# EAGLE design mainboard (EAGLE 9.5.2)

## Sheet 1 of 2
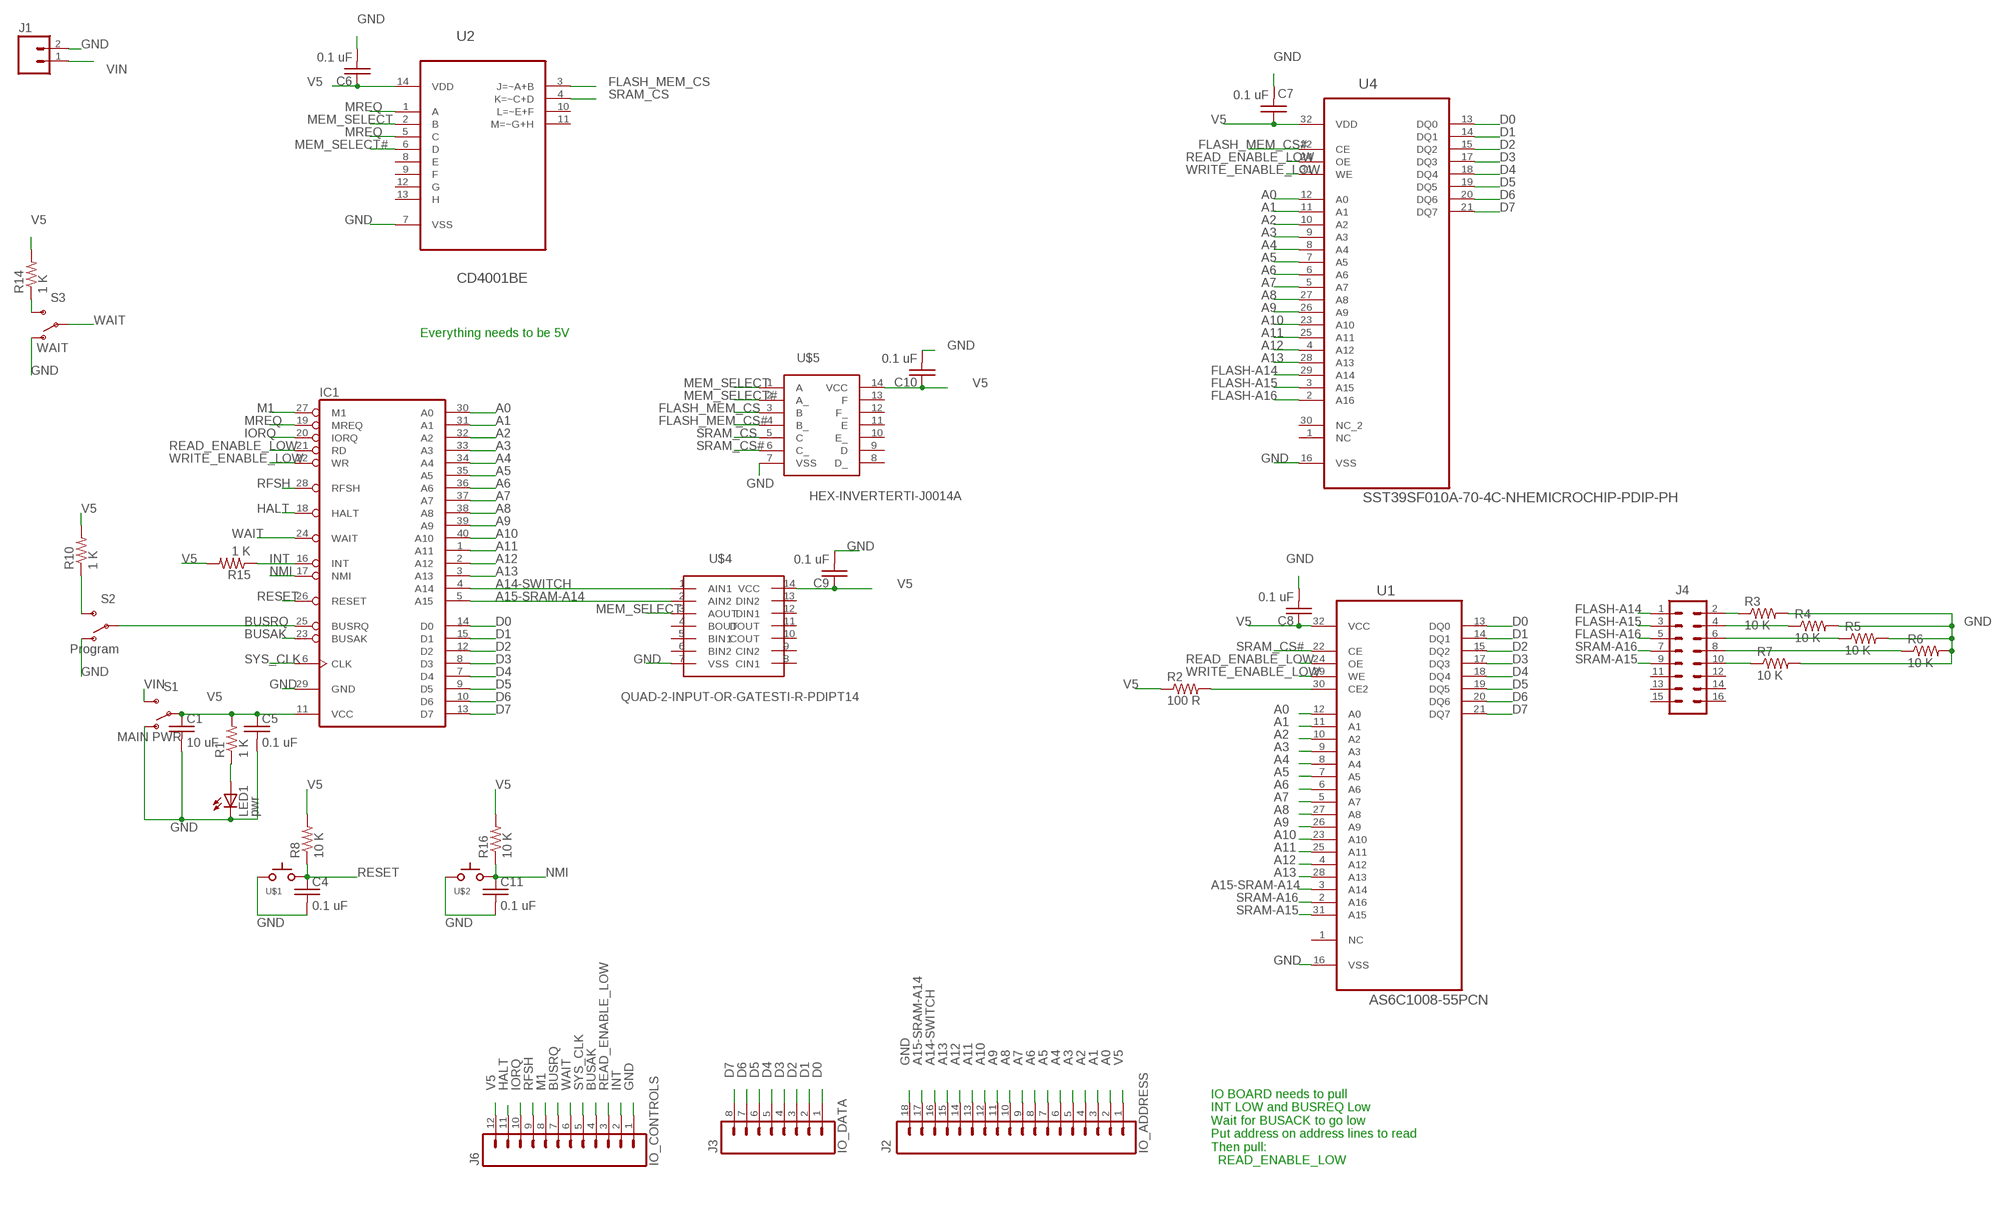
[diagram p0: schematic, sheet 1]

### Parts
C1  10 uF  C-USC0805K  [C0805K]
C4  0.1 uF  C-USC0805K  [C0805K]
C5  0.1 uF  C-USC0805K  [C0805K]
C6  0.1 uF  C-USC0805K  [C0805K]
C7  0.1 uF  C-USC0805K  [C0805K]
C8  0.1 uF  C-USC0805K  [C0805K]
C9  0.1 uF  C-USC0805K  [C0805K]
C10  0.1 uF  C-USC0805K  [C0805K]
C11  0.1 uF  C-USC0805K  [C0805K]
IC1  Z80CPU  [DIL40]
J1  M02PTH  [1X02]
J2  IO_ADDRESS  M18_  [1X18]
J3  IO_DATA  M08LOCK_LONGPADS  [1X08_LOCK_LONGPADS]
J4  M08X2  [2X8]
J6  IO_CONTROLS  M12LONGPADS  [1X12_LONGPADS]
LED1  pwr  LED1206  [LED-1206]
R1  1 K  RESISTOR0805-RES  [0805]
R2  100 R  RESISTOR0805-RES  [0805]
R3  10 K  RESISTOR0805-RES  [0805]
R4  10 K  RESISTOR0805-RES  [0805]
R5  10 K  RESISTOR0805-RES  [0805]
R6  10 K  RESISTOR0805-RES  [0805]
R7  10 K  RESISTOR0805-RES  [0805]
R8  10 K  RESISTOR0805-RES  [0805]
R10  1 K  RESISTOR0805-RES  [0805]
R14  1 K  RESISTOR0805-RES  [0805]
R15  1 K  RESISTOR0805-RES  [0805]
R16  10 K  RESISTOR0805-RES  [0805]
S1  MAIN PWR  SWITCH-SPSTKIT  [SWITCH-SPDT_KIT]
S2  Program  SWITCH-SPSTKIT  [SWITCH-SPDT_KIT]
S3  WAIT  SWITCH-SPSTKIT  [SWITCH-SPDT_KIT]
U1  AS6C1008-55PCN  [DIP254P1524X393-32]
U2  CD4001BE  [DIP254P762X508-14]
U4  SST39SF010A-70-4C-NHEMICROCHIP-PDIP-PH  [DIP1574W53P254L4191H508Q32B]
U$1  SWITCH_TACTILETACTILE-2PIN-NARROW  [TACTILE-2PIN-NARROW]
U$2  SWITCH_TACTILETACTILE-2PIN-NARROW  [TACTILE-2PIN-NARROW]
U$4  QUAD-2-INPUT-OR-GATESTI-R-PDIPT14  [DIP762W36P254L1981H508Q14B]
U$5  HEX-INVERTERTI-J0014A  [DIP797W66P254L1954H508Q14B]

### Nets
A0: IC1.30(A0) J2.2 U1.12(A0) U4.12(A0)
A1: IC1.31(A1) J2.3 U1.11(A1) U4.11(A1)
A2: IC1.32(A2) J2.4 U1.10(A2) U4.10(A2)
A3: IC1.33(A3) J2.5 U1.9(A3) U4.9(A3)
A4: IC1.34(A4) J2.6 U1.8(A4) U4.8(A4)
A5: IC1.35(A5) J2.7 U1.7(A5) U4.7(A5)
A6: IC1.36(A6) J2.8 U1.6(A6) U4.6(A6)
A7: IC1.37(A7) J2.9 U1.5(A7) U4.5(A7)
A8: IC1.38(A8) J2.10 U1.27(A8) U4.27(A8)
A9: IC1.39(A9) J2.11 U1.26(A9) U4.26(A9)
A10: IC1.40(A10) J2.12 U1.23(A10) U4.23(A10)
A11: IC1.1(A11) J2.13 U1.25(A11) U4.25(A11)
A12: IC1.2(A12) J2.14 U1.4(A12) U4.4(A12)
A13: IC1.3(A13) J2.15 U1.28(A13) U4.28(A13)
A14-SWITCH: IC1.4(A14) J2.16 U$4.1(AIN1)
A15-SRAM-A14: IC1.5(A15) J2.17 U1.3(A14) U$4.2(AIN2)
BUSAK: IC1.23(BUSAK) J6.4
BUSRQ: IC1.25(BUSRQ) J6.7 S2.2(P)
D0: IC1.14(D0) J3.1 U1.13(DQ0) U4.13(DQ0)
D1: IC1.15(D1) J3.2 U1.14(DQ1) U4.14(DQ1)
D2: IC1.12(D2) J3.3 U1.15(DQ2) U4.15(DQ2)
D3: IC1.8(D3) J3.4 U1.17(DQ3) U4.17(DQ3)
D4: IC1.7(D4) J3.5 U1.18(DQ4) U4.18(DQ4)
D5: IC1.9(D5) J3.6 U1.19(DQ5) U4.19(DQ5)
D6: IC1.10(D6) J3.7 U1.20(DQ6) U4.20(DQ6)
D7: IC1.13(D7) J3.8 U1.21(DQ7) U4.21(DQ7)
FLASH-A14: J4.1 U4.29(A14)
FLASH-A15: J4.3 U4.3(A15)
FLASH-A16: J4.5 U4.2(A16)
FLASH_MEM_CS: U2.3(J=~A+B) U$5.3(B)
FLASH_MEM_CS#: U4.22(CE) U$5.4(B_)
GND: C1.2 C4.2 C5.2 C6.2 C7.2 C8.2 C9.2 C10.2 C11.2 IC1.29(GND) J1.2 J2.18 J6.1 LED1.C R3.2 R4.2 R5.2 R6.2 R7.2 S1.1(O) S2.1(O) S3.1(O) U1.16(VSS) U2.7(VSS) U4.16(VSS) U$1.P$2(C) U$2.P$2(C) U$4.7(VSS) U$5.7(VSS)
HALT: IC1.18(HALT) J6.11
INT: IC1.16(INT) J6.2 R15.1
IORQ: IC1.20(IORQ) J6.10
M1: IC1.27(M1) J6.8
MEM_SELECT: U2.2(B) U$4.3(AOUT) U$5.1(A)
MEM_SELECT#: U2.6(D) U$5.2(A_)
MREQ: IC1.19(MREQ) U2.1(A) U2.5(C)
N$1: LED1.A R1.1
N$2: R10.1 S2.3(S)
N$4: R2.2 U1.30(CE2)
N$5: J4.2 R3.1
N$6: J4.4 R4.1
N$7: J4.6 R5.1
N$8: J4.8 R6.1
N$9: J4.10 R7.1
N$16: R14.1 S3.3(S)
NMI: C11.1 IC1.17(NMI) R16.1 U$2.P$1(A)
READ_ENABLE_LOW: IC1.21(RD) J6.3 U1.24(OE) U4.24(OE)
RESET: C4.1 IC1.26(RESET) R8.1 U$1.P$1(A)
RFSH: IC1.28(RFSH) J6.9
SRAM-A15: J4.9 U1.31(A15)
SRAM-A16: J4.7 U1.2(A16)
SRAM_CS: U2.4(K=~C+D) U$5.5(C)
SRAM_CS#: U1.22(CE) U$5.6(C_)
SYS_CLK: IC1.6(CLK) J6.5
V5: C1.1 C5.1 C6.1 C7.1 C8.1 C9.1 C10.1 IC1.11(VCC) J2.1 J6.12 R1.2 R2.1 R8.2 R10.2 R14.2 R15.2 R16.2 S1.2(P) U1.32(VCC) U2.14(VDD) U4.32(VDD) U$4.14(VCC) U$5.14(VCC)
VIN: J1.1 S1.3(S)
WAIT: IC1.24(WAIT) J6.6 S3.2(P)
WRITE_ENABLE_LOW: IC1.22(WR) U1.29(WE) U4.31(WE)
Unconnected: J4.11 J4.12 J4.13 J4.14 J4.15 J4.16 U1.1(NC) U2.8(E) U2.9(F) U2.10(L=~E+F) U2.11(M=~G+H) U2.12(G) U2.13(H) U4.1(NC) U4.30(NC_2) U$4.4(BOUT) U$4.5(BIN1) U$4.6(BIN2) U$4.8(CIN1) U$4.9(CIN2) U$4.10(COUT) U$4.11(DOUT) U$4.12(DIN1) U$4.13(DIN2) U$5.8(D_) U$5.9(D) U$5.10(E_) U$5.11(E) U$5.12(F_) U$5.13(F)

### Notes on the sheet
- Everything needs to be 5V
- IO BOARD needs to pull 
  INT LOW and BUSREQ Low
  Wait for BUSACK to go low
  Put address on address lines to read
  Then pull:
    READ_ENABLE_LOW

## Sheet 2 of 2
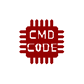
[diagram p1: schematic, sheet 2]

### Parts
U$3  CMD_C0DE_LOGOCMD_CODE_LOGO_SILK  [CMD_C0DE_LOGO_SILK]

## Library data of the parts
C1 C4-C11 = passives:C-US: CAPACITOR, American symbol
IC1 = zilog:Z80CPU: Z80 FAMILY DEVICE
J1 = connector:M02: Standard 2-pin 0.1" header. Use with - straight break away headers ( PRT-00116) - right angle break away headers (PRT-00553) - swiss pins (PRT-00743) - machine pins (PRT-00117) - female headers (PRT-00115) Molex polarized connector foot print use with: PRT-08233 with associated crimp pins and housings. 2.54_SCREWTERM for use with PRT-10571. 3.5mm Screw Terminal footprints for PRT-08084 5mm Screw Terminal footprints for use with PRT-08432
J2 = connector:M18: 1x18 .1" header
J3 = connector:M08: Header 8 Standard 8-pin 0.1" header. Use with straight break away headers (SKU : PRT-00116), right angle break away headers (PRT-00553), swiss pins (PRT-00743), machine pins (PRT-00117), and female headers (PRT-00115).
J4 = connector:M08X2: .1" headers, two rows of 8 each
J6 = connector:M12: Header 12 Standard 12-pin 0.1" header. Use with straight break away headers (SKU : PRT-00116), right angle break away headers (PRT-00553), swiss pins (PRT-00743), machine pins (PRT-00117), and female headers (PRT-00115).
LED1 = leds:LED: LEDs Standard schematic elements and footprints for 5mm, 3mm, 1206, and 0603 sized LEDs. 5mm - Spark Fun Electronics SKU : COM-00529 (and others)
R1-R8 R10 R14-R16 = passives:RESISTOR: Resistor Basic schematic elements and footprints for 0603, 1206, and PTH resistors.
S1-S3 = switches:SWITCH-SPST: SPST Switch Simple slide switch.
U1 = memories:AS6C1008-55PCN: CMOS SRAM; AVAILABILITY: Unavailable; DESCRIPTION: SRAM - Asynchronous Memory IC 1Mb _128K x 8_ Parallel 55ns 32-PDIP; MF: Alliance Memory,; MP: AS6C1008-55PCN; PACKAGE: DIP-32 Alliance Semiconductor; PRICE: None
U2 = logic:CD4001BE: CMOS NOR Gates; AVAILABILITY: Unavailable; DESCRIPTION: NOR Gate IC 4 Channel 14-PDIP; MF: Texas Instruments; MP: CD4001BE; PACKAGE: PDIP-14 Intersil; PRICE: None
U4 = memories:SST39SF010A-70-4C-NHE: 1MB Flash; DESCRIPTION: SST39SF Series 1 Mbit 128 K x 8 5 V Multi-Purpose Flash - PLCC-32; MP: SST39SF010A-70-4C-NHE
U$1 U$2 = switches:SWITCH_TACTILE
U$3 = logos:CMD_C0DE_LOGO
U$4 = logic:QUAD-2-INPUT-OR-GATES
U$5 = logic:HEX-INVERTER

## Board
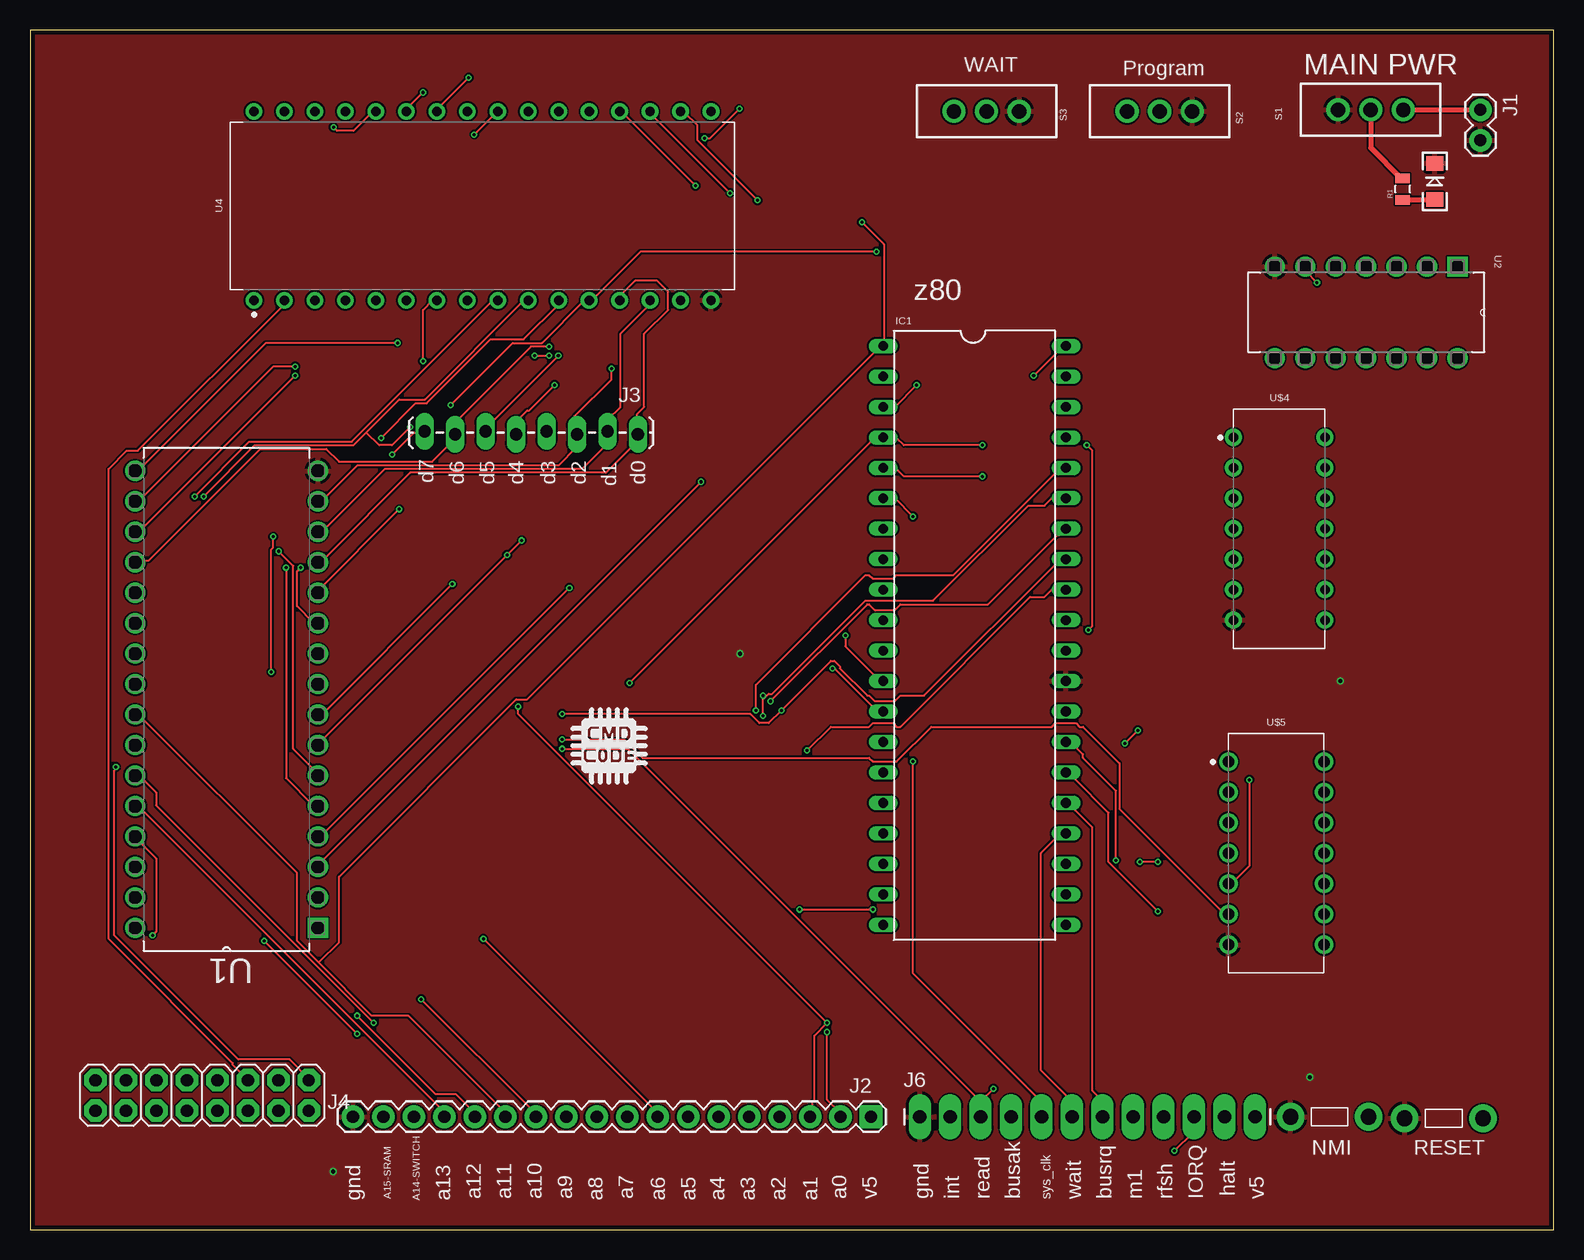
[diagram p2: board, top side]
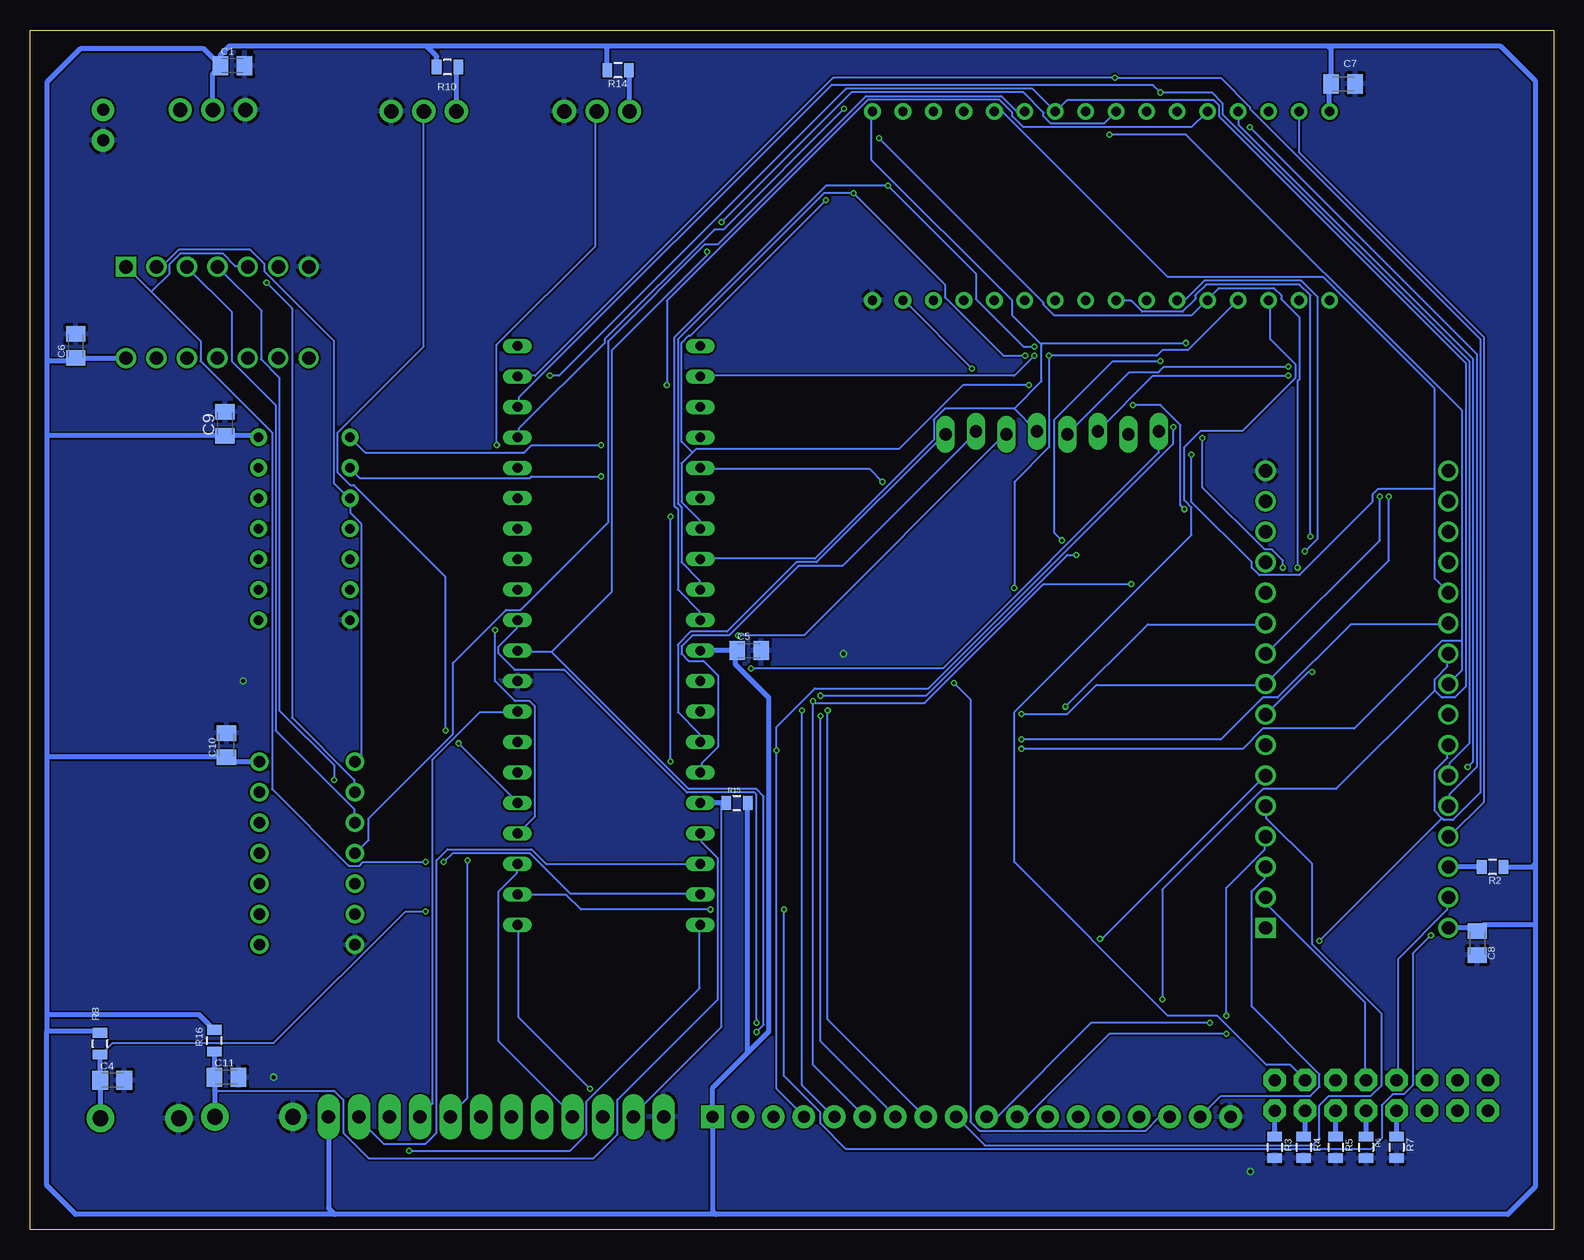
[diagram p3: board, bottom side, seen from below]

Size 127 x 100 mm. Coordinates in mm from the lower left corner, seen from the top.
Outline: 0,0 127,0 127,100 0,100 0,0
Copper layers (1*16): Top 0.035559375mm / dielectric 1.6mm / Bottom 0.035559375mm
Design rules "oshpark-2layer": minimum track width 6mil, minimum drill 10mil, track to track 6mil, track to pad 6mil, pad to pad 6mil, via to via 6mil, smd to smd 6mil, copper to edge 15mil, drill to drill 6mil, minimum pad ring 5mil, minimum via ring 5mil, stop-mask expansion 2.5mil, vias tented up to drill 0mil, thermal gap 10mil

### Footprints (pad centres in the part's own frame; a part is rotated, then mirrored left to right if it is on the bottom)
C0805K = smd 1.3 x 1.6: 1 -1,0; 2 1,0
DIL40 = drill 0.813 long: 1 -24.13,-7.62; 2 -21.59,-7.62; 3 -19.05,-7.62; 4 -16.51,-7.62; 5 -13.97,-7.62; 6 -11.43,-7.62; 7 -8.89,-7.62; 8 -6.35,-7.62; 9 -3.81,-7.62; 10 -1.27,-7.62; 11 1.27,-7.62; 12 3.81,-7.62; 13 6.35,-7.62; 14 8.89,-7.62; 15 11.43,-7.62; 16 13.97,-7.62; 17 16.51,-7.62; 18 19.05,-7.62; 19 21.59,-7.62; 20 24.13,-7.62; 21 24.13,7.62; 22 21.59,7.62; 23 19.05,7.62; 24 16.51,7.62; 25 13.97,7.62; 26 11.43,7.62; 27 8.89,7.62; 28 6.35,7.62; 29 3.81,7.62; 30 1.27,7.62; 31 -1.27,7.62; 32 -3.81,7.62; 33 -6.35,7.62; 34 -8.89,7.62; 35 -11.43,7.62; 36 -13.97,7.62; 37 -16.51,7.62; 38 -19.05,7.62; 39 -21.59,7.62; 40 -24.13,7.62
1X02 = drill 1.016 pad 1.88: 1 0,0; 2 2.54,0
1X18 = drill 1.016 pad 1.88 square: 1 0,0 | drill 1.016 pad 1.88: 2 2.54,0; 3 5.08,0; 4 7.62,0; 5 10.16,0; 6 12.7,0; 7 15.24,0; 8 17.78,0; 9 20.32,0; 10 22.86,0; 11 25.4,0; 12 27.94,0; 13 30.48,0; 14 33.02,0; 15 35.56,0; 16 38.1,0; 17 40.64,0; 18 43.18,0
1X08_LOCK_LONGPADS = drill 1.016 long: 1 0,0.127; 2 2.54,-0.127; 3 5.08,0.127; 4 7.62,-0.127; 5 10.16,0.127; 6 12.7,-0.127; 7 15.24,0.127; 8 17.78,-0.127
2X8 = drill 1.016 pad 1.88 octagon: 1 0,0; 2 0,2.54; 3 2.54,0; 4 2.54,2.54; 5 5.08,0; 6 5.08,2.54; 7 7.62,0; 8 7.62,2.54; 9 10.16,0; 10 10.16,2.54; 11 12.7,0; 12 12.7,2.54; 13 15.24,0; 14 15.24,2.54; 15 17.78,0; 16 17.78,2.54
1X12_LONGPADS = drill 1.118 pad 1.88 long: 1 0,0; 2 2.54,0; 3 5.08,0; 4 7.62,0; 5 10.16,0; 6 12.7,0; 7 15.24,0; 8 17.78,0; 9 20.32,0; 10 22.86,0; 11 25.4,0; 12 27.94,0
LED-1206 = smd 1.2 x 1.4: A -1.5,0; C 1.5,0
0805 = smd 0.8 x 1.2: 1 -0.9,0; 2 0.9,0
SWITCH-SPDT_KIT = drill 1.2 pad 1.93: 1 0,2.718; 2 0,0; 3 0,-2.718
DIP254P1524X393-32 = drill 1.118 square: 1 -15.24,38.1 | drill 1.118: 2 -15.24,35.56; 3 -15.24,33.02; 4 -15.24,30.48; 5 -15.24,27.94; 6 -15.24,25.4; 7 -15.24,22.86; 8 -15.24,20.32; 9 -15.24,17.78; 10 -15.24,15.24; 11 -15.24,12.7; 12 -15.24,10.16; 13 -15.24,7.62; 14 -15.24,5.08; 15 -15.24,2.54; 16 -15.24,0; 17 0,0; 18 0,2.54; 19 0,5.08; 20 0,7.62; 21 0,10.16; 22 0,12.7; 23 0,15.24; 24 0,17.78; 25 0,20.32; 26 0,22.86; 27 0,25.4; 28 0,27.94; 29 0,30.48; 30 0,33.02; 31 0,35.56; 32 0,38.1
DIP254P762X508-14 = drill 1.118 square: 1 -7.62,15.24 | drill 1.118: 2 -7.62,12.7; 3 -7.62,10.16; 4 -7.62,7.62; 5 -7.62,5.08; 6 -7.62,2.54; 7 -7.62,0; 8 0,0; 9 0,2.54; 10 0,5.08; 11 0,7.62; 12 0,10.16; 13 0,12.7; 14 0,15.24
DIP1574W53P254L4191H508Q32B = drill 0.788 pad 1.388: 1 -7.874,19.05; 2 -7.874,16.51; 3 -7.874,13.97; 4 -7.874,11.43; 5 -7.874,8.89; 6 -7.874,6.35; 7 -7.874,3.81; 8 -7.874,1.27; 9 -7.874,-1.27; 10 -7.874,-3.81; 11 -7.874,-6.35; 12 -7.874,-8.89; 13 -7.874,-11.43; 14 -7.874,-13.97; 15 -7.874,-16.51; 16 -7.874,-19.05; 17 7.874,-19.05; 18 7.874,-16.51; 19 7.874,-13.97; 20 7.874,-11.43; 21 7.874,-8.89; 22 7.874,-6.35; 23 7.874,-3.81; 24 7.874,-1.27; 25 7.874,1.27; 26 7.874,3.81; 27 7.874,6.35; 28 7.874,8.89; 29 7.874,11.43; 30 7.874,13.97; 31 7.874,16.51; 32 7.874,19.05
TACTILE-2PIN-NARROW = drill 1.3 pad 2.3: P$1 3.264,0; P$2 -3.264,0
DIP762W36P254L1981H508Q14B = drill 0.8 pad 1.422: 1 -3.81,7.62; 2 -3.81,5.08; 3 -3.81,2.54; 4 -3.81,0; 5 -3.81,-2.54; 6 -3.81,-5.08; 7 -3.81,-7.62; 8 3.81,-7.62; 9 3.81,-5.08; 10 3.81,-2.54; 11 3.81,0; 12 3.81,2.54; 13 3.81,5.08; 14 3.81,7.62
DIP797W66P254L1954H508Q14B = drill 0.952 pad 1.552: 1 -3.985,7.62; 2 -3.985,5.08; 3 -3.985,2.54; 4 -3.985,0; 5 -3.985,-2.54; 6 -3.985,-5.08; 7 -3.985,-7.62; 8 3.985,-7.62; 9 3.985,-5.08; 10 3.985,-2.54; 11 3.985,0; 12 3.985,2.54; 13 3.985,5.08; 14 3.985,7.62

### Placement (x,y rotation side)
C1  110.11,97.03 0 bottom
C4  120.14,12.45 0 bottom
C5  67.06,48.26 0 bottom
C6  123.19,73.66 90 bottom
C7  17.53,95.5 0 bottom
C8  6.35,23.88 270 bottom
C9  110.74,67.18 90 bottom
C10  110.62,40.39 90 bottom
C11  110.62,12.7 0 bottom
IC1  78.74,49.53 270 top
J1  120.9,93.34 270 top
J2  70.1,9.4 180 top
J3  50.67,66.42 180 top
J4  23.24,12.45 180 top
J6  74.17,9.4 0 top
LED1  117.09,87.38 90 top
R1  114.43,86.74 90 top
R2  5.08,30.23 180 bottom
R3  23.24,6.86 270 bottom
R4  20.83,6.86 270 bottom
R5  18.16,6.86 270 bottom
R6  15.62,6.86 270 bottom
R7  13.08,6.86 270 bottom
R8  121.16,15.49 90 bottom
R10  92.2,96.9 180 bottom
R14  77.98,96.65 180 bottom
R15  68.07,35.56 0 bottom
R16  111.63,15.75 90 bottom
S1  111.76,93.34 90 top
S2  94.17,93.22 270 top
S3  79.74,93.22 270 top
U1  8.76,63.25 180 top
U2  103.76,72.64 270 top
U4  37.72,85.34 90 top
U$1  117.86,9.27 0 top
U$2  108.33,9.4 0 top
U$3  48.26,40.64 0 top
U$4  104.14,58.42 0 top
U$5  103.89,31.37 0 top

### Tracks (layer width: path | path; a pad name or v marks a point on that pad's centre or on a via)
A0  (via drill 0.25)
  Top 0.152: v35.05,68.73 40.23,73.91 42.67,73.91 46.18,77.42 46.48,77.42 U4.12 46.63,77.57 46.94,77.57 50.9,81.53 v70.56,81.53 | v30.79,60.05 23.93,53.19 U1.12 | v66.45,16.46 66.45,10.82 67.51,9.75 67.51,9.45 J2.2
  Bottom 0.152: v35.05,68.73 32.77,68.73 31.09,67.06 31.09,60.35 v30.79,60.05 | 83.52,48.16 86.26,48.16 IC1.30 | 83.52,48.16 72.08,36.73 66.45,36.73 65.84,36.12 65.84,17.07 v66.45,16.46 | v70.56,81.53 70.56,81.23 78.49,73.3 78.49,53.19 83.52,48.16
A1  (via drill 0.25)
  Top 0.152: v29.26,65.99 32.16,68.89 33.07,68.89 38.41,74.22 41.15,74.22 44.04,77.11 44.04,77.42 U4.11 | v22.55,55.17 22.25,54.86 22.25,51.97 23.62,50.6 23.93,50.6 U1.11 | J2.3 65.23,9.6 65.23,10.67 65.38,10.82 65.38,16.15 v66.45,17.22 40.69,42.98 v40.69,43.59
  Bottom 0.152: v29.26,65.99 29.26,61.87 24.08,56.69 23.47,56.69 22.55,55.78 v22.55,55.17 | v66.45,17.22 66.45,36.27 66.6,36.42 72.24,36.42 82.45,46.63 86.56,46.63 87.94,48.01 87.94,48.62 86.41,50.14 86.41,50.75 IC1.31 | v40.69,43.59 33.83,50.44 24.08,50.44 U1.11
A2  (via drill 0.25)
  Top 0.152: 28.04,66.45 26.98,65.38 18.75,65.38 v14.48,61.11 | 28.04,66.45 30.79,69.19 32.92,69.19 41.15,77.42 41.45,77.42 U4.10 | IC1.32 85.19,53.34 84.58,52.73 83.36,52.73 72.54,41.91 72.24,41.91 71.93,42.22 70.26,42.22 69.95,41.91 66.75,41.91 v64.77,39.93 | 28.04,66.45 29.11,65.38 30.18,65.38 v31.7,66.9
  Bottom 0.152: v14.48,61.11 14.48,57.45 23.93,48.01 U1.10 | J2.4 62.48,9.45 64.77,11.73 v64.77,39.93 64.77,41.91 61.57,45.11 52.12,45.11 31.7,65.53 v31.7,66.9
A3  (via drill 0.25)
  Top 0.152: v13.72,61.11 18.29,65.68 26.82,65.68 38.56,77.42 38.86,77.42 U4.9 | IC1.33 86.26,55.78 85.8,55.78 74.52,44.5 72.54,44.5 72.08,44.04 70.41,44.04 69.95,44.5 69.8,44.5 67.51,46.79 67.51,46.94 67.06,47.4 66.75,47.4 v62.64,43.28 61.57,42.22 60.81,42.22 60.05,42.98 v44.35,42.98
  Bottom 0.152: v13.72,61.11 13.72,55.78 23.93,45.57 U1.9 24.08,45.41 38.1,45.41 40.54,42.98 v44.35,42.98 | v62.64,43.28 62.64,12.04 60.05,9.45 J2.5
A4  (via drill 0.25)
  Top 0.152: v20.27,57.76 20.27,56.84 20.12,56.69 v20.12,46.48 | v61.72,44.04 69.8,52.12 69.95,52.12 70.41,51.66 72.08,51.66 72.54,52.12 79.86,52.12 85.65,57.91 85.8,57.91 86.26,58.37 IC1.34 | v35.2,53.8 24.38,42.98 24.08,42.98 U1.8
  Bottom 0.152: v20.27,57.76 20.27,77.88 21.18,78.79 28.96,78.79 29.87,77.88 29.87,77.57 30.94,76.5 34.29,76.5 35.2,77.42 36.42,77.42 U4.8 | v20.12,46.48 20.42,46.48 23.93,42.98 U1.8 | 61.72,43.89 61.72,13.72 J2.6 | v35.2,53.8 42.52,53.8 52.43,43.89 61.72,43.89 | 61.72,43.89 v61.72,44.04
A5  (via drill 0.25)
  Top 0.152: v32.77,72.39 32.77,76.66 33.53,77.42 33.83,77.42 U4.7 | v41,57.45 v39.78,56.24 23.93,40.39 U1.7 | IC1.35 85.19,60.96 84.58,60.35 83.21,60.35 75.29,52.43 69.65,52.43 61.87,44.65 61.57,44.65 61.27,44.35 | 61.27,44.35 61.11,44.2 v61.11,42.82 | 61.27,44.35 v61.11,44.5
  Bottom 0.152: v32.77,72.39 36.73,72.39 41.6,67.51 41.6,58.06 v41,57.45 | v61.11,42.82 61.11,15.7 54.86,9.45 J2.7 | v39.78,56.24 40.54,56.24 52.27,44.5 v61.11,44.5
A6  (via drill 0.25)
  Top 0.152: v20.73,56.54 21.95,55.32 21.95,40.08 24.08,37.95 U1.6 | v60.5,43.28 60.5,45.41 69.65,54.56 69.95,54.56 70.26,54.25 71.93,54.25 72.24,54.56 76.96,54.56 85.8,63.4 86.26,63.4 IC1.36 | v37.8,24.23 52.27,9.75 52.27,9.45 J2.8
  Bottom 0.152: v20.73,56.54 19.66,57.61 19.66,77.72 21.03,79.1 29.11,79.1 30.63,77.57 31.24,77.57 U4.6 | v60.5,43.28 60.5,17.53 52.43,9.45 J2.8 | v37.8,24.23 37.64,24.23 24.08,37.8 U1.6
A7  (via drill 0.25)
  Top 0.152: v59.13,93.42 56.69,90.98 v56.24,90.98 | v21.34,55.17 21.34,37.64 23.62,35.36 23.93,35.36 U1.5
  Bottom 0.152: J2.9 47.4,7.01 20.12,7.01 19.51,7.62 19.51,10.36 18.75,11.12 15.24,11.12 14.33,12.04 14.33,17.98 20.12,23.77 20.12,30.48 23.93,34.29 23.93,35.2 U1.5 | v59.13,93.42 69.19,83.36 69.95,83.36 79.1,74.22 79.1,73.91 86.26,66.75 86.26,66.14 IC1.37 | v56.24,90.98 42.52,77.27 42.52,77.11 41.6,76.2 30.18,76.2 28.96,77.42 U4.5 28.8,77.57 27.89,78.49 23.32,78.49 22.71,77.88 22.71,77.57 21.18,76.05 21.18,70.87 21.34,70.71 v21.34,55.17
A8  (via drill 0.25)
  Top 0.152: v32.77,94.79 31.24,93.27 U4.27 | v28.65,17.22 10.52,35.36 10.52,36.42 9.14,37.8 8.84,37.8 U1.27
  Bottom 0.152: IC1.38 86.26,68.58 86.26,69.34 60.2,95.4 33.38,95.4 v32.77,94.79 28.5,94.79 27.58,93.88 27.58,92.96 7.01,72.39 7.01,40.54 8.69,38.86 8.69,37.95 U1.27 | v28.65,17.22 38.56,17.22 46.33,9.45 47.24,9.45 J2.10
A9  (via drill 0.25)
  Top 0.152: v36.58,96.01 33.83,93.27 U4.26 | v19.51,24.08 v27.28,16.31
  Bottom 0.152: IC1.39 86.26,71.17 84.89,71.17 60.05,96.01 v36.58,96.01 27.74,96.01 25.3,93.57 25.3,93.42 6.1,74.22 6.1,36.42 8.38,34.14 9.14,34.14 9.3,34.29 | 9.3,34.29 9.91,34.9 9.91,38.25 8.84,39.32 8.84,40.39 U1.26 | v27.28,16.31 37.03,16.31 43.89,9.45 44.65,9.45 J2.11 | 9.3,34.29 v19.51,24.08
A10  (via drill 0.25)
  Top 0.152: v83.67,71.17 85.65,73.15 85.8,73.15 86.26,73.61 IC1.40 | v32.61,19.2 42.06,9.75 42.06,9.45 J2.12
  Bottom 0.152: v83.67,71.17 82.91,71.17 58.98,95.1 43.43,95.1 41.6,93.27 U4.23 41.45,93.27 40.54,94.18 28.35,94.18 27.89,93.73 27.89,92.81 7.32,72.24 7.32,45.26 8.23,44.35 9.3,44.35 9.91,44.96 | 9.91,44.96 9.91,45.87 8.84,46.94 8.84,48.01 U1.23 | v32.61,19.2 32.61,28.35 24.23,36.73 18.14,36.73 9.91,44.96
A11  (via drill 0.25)
  Top 0.152: v69.34,83.97 71.17,82.14 71.17,73.76 IC1.1 71.02,73.61 70.56,73.15 70.41,73.15 41.45,44.2 40.54,44.2 25.76,29.41 25.76,23.93 24.08,22.25 | 24.08,22.25 28.5,17.83 31.55,17.83 39.62,9.75 J2.13 | 24.08,22.25 22.25,24.08 22.25,29.72 9.14,42.82 8.84,42.82 U1.25
  Bottom 0.152: v69.34,83.97 58.52,94.79 44.2,94.79 42.52,93.12 42.52,92.81 41.91,92.2 37.49,92.2 36.58,93.12 U4.25
A12  (via drill 0.25)
  Top 0.152: v27.28,17.83 33.83,11.28 35.51,11.28 37.03,9.75 37.03,9.45 J2.14 | v42.06,72.85 v43.28,72.85 | v44.96,53.49 24.69,33.22 24.54,33.22 24.08,32.77 U1.4
  Bottom 0.152: v27.28,17.83 27.28,28.5 24.08,31.7 24.08,32.77 U1.4 | v43.28,72.85 44.96,71.17 71.02,71.17 IC1.2 | U4.4 26.36,77.42 30.48,73.3 32.61,73.3 33.07,72.85 v42.06,72.85 42.06,65.23 44.96,62.33 v44.96,53.49
A13  (via drill 0.25)
  Top 0.152: U1.28 8.84,35.2 9.14,35.2 34.44,9.91 34.44,9.45 J2.15 | IC1.3 72.08,68.58 v73.91,70.41 | v25.3,91.9 25.6,91.59 26.98,91.59 28.5,93.12 28.8,93.12 U4.28
  Bottom 0.152: v73.91,70.41 73.91,77.42 57.15,94.18 46.18,94.18 45.11,93.12 45.11,92.81 44.2,91.9 30.18,91.9 28.96,93.12 U4.28 | v25.3,91.9 6.4,73 6.4,38.56 8.69,36.27 8.69,35.36 U1.28
A14-SWITCH  (via drill 0.25)
  Top 0.152: v79.4,65.38 72.85,65.38 72.24,65.99 71.17,65.99 IC1.4 71.02,65.99 70.41,65.99 v49.99,45.57
  Bottom 0.152: v79.4,65.38 85.19,65.38 85.8,64.77 99.06,64.77 U$4.1 | v49.99,45.57 48.62,44.2 48.62,8.99 47.85,8.23 33.98,8.23 32.92,9.3 32,9.3 J2.16
A15-SRAM-A14  (via drill 0.25)
  Top 0.152: v79.4,62.79 72.85,62.79 72.24,63.4 71.17,63.4 IC1.5 | v55.93,62.33 23.93,30.33 U1.3
  Bottom 0.152: v79.4,62.79 85.19,62.79 85.34,62.64 99.52,62.64 100.28,63.4 U$4.2 | J2.17 27.74,11.12 20.27,11.12 19.51,11.89 19.51,12.95 25.15,18.59 25.15,28.19 24.08,29.26 24.08,30.18 U1.3 | v55.93,62.33 57,63.4 71.02,63.4 IC1.5
BUSAK
  Bottom 0.152: IC1.23 86.41,30.48 86.41,29.72 87.94,28.19 87.94,15.7 81.69,9.45 J6.4
BUSRQ  (via drill 0.25)
  Top 0.152: IC1.25 86.87,35.05 87.02,35.05 88.54,33.53 88.54,11.58 89.31,10.82 89.31,9.45 J6.7 | v91.29,40.54 v92.35,41.6
  Bottom 0.152: v92.35,41.6 92.35,54.41 99.97,62.03 100.28,62.03 101.35,63.09 101.35,66.45 94.18,73.61 94.18,93.12 S2.2 | v91.29,40.54 86.41,35.66 IC1.25
D0
  Top 0.152: 50.6,66.29 50.6,67.97 51.21,68.58 51.21,74.68 53.19,76.66 53.19,78.18 52.27,79.1 50.44,79.1 49.23,77.88 49.23,77.57 U4.13 | 50.6,66.29 50.6,65.68 48.01,63.09 31.7,63.09 24.69,56.08 24.54,56.08 24.08,55.63 U1.13 | 50.6,66.29 J3.1
  Bottom 0.152: IC1.14 71.17,40.69 71.17,41.3 73,43.13 73,48.77 71.93,49.84 68.89,49.84 63.09,55.63 61.42,55.63 50.75,66.29 J3.1
D1
  Top 0.152: U4.14 51.66,77.42 51.66,77.11 49.23,74.68 49.23,68.58 48.16,67.51 48.16,66.6 J3.2 48.01,66.45 48.01,65.38 46.02,63.4 29.57,63.4 24.38,58.22 24.08,58.22 U1.14
  Bottom 0.152: IC1.15 71.02,38.1 71.02,38.86 69.65,40.23 69.65,46.18 70.87,47.4 72.08,47.4 72.69,48.01 72.69,48.62 71.78,49.53 68.73,49.53 62.94,55.32 59.28,55.32 48.16,66.45 J3.2
D2  (via drill 0.25)
  Top 0.152: v67.97,49.53 67.97,48.62 70.41,46.18 70.56,46.18 71.02,45.72 IC1.12 | v48.46,71.78 48.46,70.87 45.41,67.82 45.41,66.45 45.57,66.29 | 45.57,66.29 45.57,65.23 44.04,63.7 27.28,63.7 24.38,60.81 24.08,60.81 U1.15 | 45.57,66.29 J3.3
  Bottom 0.152: v67.97,49.53 62.48,49.53 45.72,66.29 J3.3 | v48.46,71.78 54.1,77.42 U4.15
D3  (via drill 0.25)
  Top 0.152: v30.63,73.91 19.66,73.91 9.45,63.7 9.3,63.7 8.84,63.25 U1.17
  Bottom 0.152: 44.96,68.43 50.75,68.43 51.66,67.51 51.66,65.84 61.57,55.93 71.02,55.93 IC1.8 | 44.96,68.43 43.13,66.6 J3.4 | 42.82,73.91 42.67,73.76 42.67,70.71 44.96,68.43 | 42.82,73.91 45.11,76.2 45.11,77.42 56.84,89.15 56.84,93.12 U4.17 | 42.82,73.91 v30.63,73.91
D4  (via drill 0.25)
  Top 0.152: v43.74,70.41 41.6,68.28 41.45,68.28 40.54,67.36 40.54,66.29 J3.5 | v60.66,85.8 55.63,90.83 55.63,92.05 54.56,93.12 54.25,93.12 U4.18 | v22.1,71.93 20.27,71.93 9.14,60.81 8.84,60.81 U1.18
  Bottom 0.152: 71.78,64.77 71.48,65.08 54.56,65.08 49.23,70.41 v43.74,70.41 | 71.78,64.77 72.69,63.86 72.69,60.66 71.17,59.13 71.17,58.52 IC1.7 | v60.66,85.8 71.93,74.52 72.08,74.52 72.69,73.91 72.69,65.68 71.78,64.77 | v22.1,71.93 32.46,71.93 32.92,71.48 35.36,71.48 40.54,66.29 J3.5
D5  (via drill 0.25)
  Top 0.152: v58.37,86.41 51.66,93.12 U4.19 | v44.04,72.85 38.1,66.9 38.1,66.6 J3.6 | v22.1,71.17 9.14,58.22 8.84,58.22 U1.19
  Bottom 0.152: IC1.9 71.17,53.34 71.17,54.1 72.69,55.63 72.69,60.2 73,60.5 73,74.22 60.81,86.41 v58.37,86.41 50.75,78.79 50.75,77.72 45.87,72.85 v44.04,72.85 | v22.1,71.17 33.38,71.17 37.95,66.6 J3.6
D6  (via drill 0.25)
  Top 0.152: U1.20 8.84,55.63 8.99,55.78 9.91,55.78 19.2,65.08 24.69,65.08 25.76,64.01 33.53,64.01 35.36,65.84 35.36,66.29 J3.7 35.51,66.29 35.51,67.36 41.76,73.61 v43.28,73.61 | v55.47,87.02 49.23,93.27 U4.20
  Bottom 0.152: IC1.10 71.17,50.9 71.17,51.51 73,53.34 73,60.05 73.3,60.35 73.3,74.37 60.66,87.02 v55.47,87.02 48.16,79.7 48.16,77.57 44.2,73.61 v43.28,73.61
D7  (via drill 0.25)
  Top 0.152: v66.9,46.79 67.06,46.79 70.56,43.28 71.02,43.28 IC1.13 | v30.18,64.62 32,66.45 32.77,66.45 J3.8
  Bottom 0.152: v66.9,46.79 50.9,46.79 32.92,64.77 32.92,66.45 J3.8 | 9.91,61.72 9.91,54.25 8.84,53.19 U1.21 | 9.91,61.72 9.91,70.1 19.2,79.4 32.16,79.4 45.87,93.12 46.48,93.12 U4.21 | v30.18,64.62 30.18,60.66 25.15,55.63 25.15,55.17 24.54,54.56 21.18,54.56 15.09,60.66 15.09,61.27 14.63,61.72 9.91,61.72
FLASH-A14  (via drill 0.25)
  Top 0.152: v7.16,38.56 7.16,38.41 7.01,38.25 7.01,24.54 17.37,14.17 21.64,14.17 23.32,12.5 J4.1
  Bottom 0.152: v7.16,38.56 6.71,39.01 6.71,72.54 26.21,92.05 26.21,93.12 U4.29
FLASH-A15
  Bottom 0.152: U4.3 23.62,77.42 23.62,74.22 21.49,72.08 21.49,71.02 25.91,66.6 29.41,66.6 30.79,65.23 30.79,60.81 30.18,60.2 30.18,57.91 44.96,43.13 44.96,30.63 32.16,17.83 28.04,17.83 23.93,13.72 21.95,13.72 20.73,12.5 J4.3
FLASH-A16
  Top 0.152: U4.2 21.18,77.42 21.18,77.11 8.99,64.92 8.08,64.92 6.55,63.4 6.55,24.23 16.92,13.87 16.92,13.72 18.14,12.5 J4.5
FLASH_MEM_CS
  Bottom 0.152: U$5.3 99.97,33.98 99.97,35.05 106.53,41.6 106.53,68.73 110.19,72.39 110.19,76.5 113.84,80.16 U2.3
FLASH_MEM_CS#
  Bottom 0.152: U4.22 44.2,93.27 44.81,93.27 46.02,94.49 57.3,94.49 69.65,82.14 70.71,82.14 78.79,74.07 78.79,58.98 86.11,51.66 87.33,51.66 91.75,47.24 91.75,41.3 98.75,34.29 98.75,32.46 99.82,31.39 U$5.4
GND  (via drill 0.35)
  Top 0.152: 117.5,89 LED1.C
  Bottom 0.152: 18.5,6 R5.2 18,6 | 20.5,6 R4.2 21,6 | 23,6 R3.2 23.5,6 | 13.5,6 R7.2 13,6 | 15.5,6 R6.2 16,6 | 6,22.5 C8.2 | 110.5,41 C10.2 | 119,12 C4.2 | 109.5,12.5 C11.2 | 17,95.5 C7.2 | 66,48.5 C5.2 | 111,68.5 C9.2 110.5,68 | 123,74.5 C6.2 | 109,97 C1.2
  other vias: 109.22,45.72 25.27,4.83 106.68,12.7 59.18,48.01
  pour Top: 0,100.33 0,0 127,0 127,100.33
  pour Bottom: -1.27,101.6 -1.27,-1.27 128.27,-1.27 128.27,100.33 127,101.6 0,101.6
HALT
  Bottom 0.152: IC1.18 83.97,30.48 85.19,31.7 92.2,31.7 93.12,30.79 93.12,8.08 94.03,7.16 97.54,7.16 99.67,9.3 J6.11
INT
  Bottom 0.152: R15.1 69.34,35.51 69.34,16.92 76.81,9.45 J6.2
  Bottom 0.406: R15.1 IC1.16
IORQ  (via drill 0.25)
  Top 0.152: v95.4,6.55 96.93,8.08 96.93,9.3 J6.10
  Bottom 0.152: v95.4,6.55 81.99,6.55 80.62,7.92 80.62,10.67 71.17,20.12 71.17,25.3 IC1.20
M1  (via drill 0.25)
  Top 0.152: v90.53,30.79 90.53,36.58 87.78,39.32 87.78,39.62 86.87,40.54 86.41,40.54 IC1.27
  Bottom 0.152: v90.53,30.79 90.53,10.97 92.05,9.45 J6.8
MEM_SELECT
  Bottom 0.152: U$5.1 99.82,39.01 99.36,39.47 99.36,58.83 100.28,59.74 100.28,60.96 U$4.3 100.43,60.96 101.65,62.18 101.65,74.07 107.44,79.86 107.44,80.47 108.66,81.69 114.61,81.69 115.98,80.31 116.43,80.31 U2.2
MEM_SELECT#  (via drill 0.25)
  Top 0.152: v107.29,78.94 106.38,79.86 106.38,80.16 U2.6
  Bottom 0.152: v107.29,78.94 105.16,76.81 105.16,42.67 99.97,37.49 99.97,36.58 U$5.2
MREQ  (via drill 0.25)
  Top 0.152: v94.03,30.63 v92.51,30.63
  Bottom 0.152: v92.51,30.63 91.75,31.39 85.34,31.39 81.99,28.04 71.17,28.04 IC1.19 | v94.03,30.63 99.21,30.63 99.52,30.33 100.43,30.33 106.83,36.73 106.83,66.45 112.78,72.39 112.78,74.07 116.89,78.18 | 116.89,78.18 118.87,80.16 U2.1 | 116.89,78.18 115.37,79.7 115.37,80.47 114.45,81.38 110.95,81.38 109.88,80.31 108.97,80.31 U2.5
N$1
  Top 0.406: R1.1 117.06,85.84 LED1.A
N$2
  Bottom 0.406: S2.3 91.45,96.75 R10.1
N$4
  Bottom 0.406: R2.2 U1.30
N$5
  Bottom 0.406: R3.1 J4.2
N$6
  Bottom 0.406: R4.1 20.7,7.88 J4.4
N$7
  Bottom 0.406: R5.1 J4.6
N$8
  Bottom 0.406: R6.1 J4.8
N$9
  Bottom 0.406: R7.1 J4.10
N$16
  Bottom 0.406: S3.3 77.02,96.59 R14.1
NMI
  Bottom 0.152: 111.62,11.58 101.65,11.58 100.89,10.82 100.89,8.08 98.75,5.94 80.01,5.94 78.03,7.92 78.03,10.82 69.65,19.2 69.65,30.94 71.02,32.31 71.02,32.92 IC1.17
  Bottom 0.406: U$2.P$1 111.62,9.42 111.62,11.58 C11.1 111.62,14.83 R16.1
READ_ENABLE_LOW  (via drill 0.25)
  Top 0.152: 79.25,10.67 v80.31,11.73 | v37.03,91.29 38.86,93.12 U4.24 | 79.25,10.67 49.84,40.08 v44.35,40.08 | 79.25,10.67 J6.3
  Bottom 0.152: v80.31,11.73 86.26,17.68 86.26,25.3 IC1.21 | v37.03,91.29 30.63,91.29 7.62,68.28 7.62,49.07 | 7.62,49.07 7.62,46.63 8.69,45.57 U1.24 | v44.35,40.08 25.91,40.08 24.23,41.76 16.61,41.76 9.3,49.07 7.62,49.07
RESET  (via drill 0.25)
  Top 0.152: v94.03,26.52 89.92,30.63 89.92,34.75 87.02,37.64 86.87,37.64 86.41,38.1 IC1.26
  Bottom 0.152: v94.03,26.52 95.71,26.52 106.68,15.54 120.09,15.54 121.01,14.63 R8.1
  Bottom 0.406: U$1.P$1 121.14,9.29 C4.1 121.14,14.58 R8.1
RFSH
  Bottom 0.152: IC1.28 86.41,43.13 89.46,43.13 93.42,39.17 93.42,10.52 94.49,9.45 J6.9
SRAM-A15
  Bottom 0.152: U1.31 8.84,27.58 8.84,26.67 12.95,22.55 12.95,12.5 J4.9
SRAM-A16
  Bottom 0.152: U1.2 23.93,27.58 23.93,27.13 15.7,18.9 15.7,12.5 J4.7
SRAM_CS  (via drill 0.25)
  Top 0.152: v101.65,37.49 101.65,30.33 100.28,28.96 99.97,28.96 U$5.5
  Bottom 0.152: v101.65,37.49 101.65,38.71 106.22,43.28 106.22,71.02 107.75,72.54 107.75,76.66 111.25,80.16 U2.4
SRAM_CS#  (via drill 0.25)
  Top 0.152: v44.35,40.84 49.53,40.84 51.05,39.32 69.95,39.32 70.26,39.01 72.24,39.01 75.13,41.91 85.19,41.91 85.5,42.22 87.17,42.22 87.48,41.91 87.78,41.91 90.83,38.86 90.83,35.05 99.52,26.36 99.82,26.36 U$5.6
  Bottom 0.152: v44.35,40.84 27.74,40.84 24.23,44.35 23.01,44.35 16.92,50.44 8.84,50.44 U1.22
SYS_CLK  (via drill 0.25)
  Top 0.152: IC1.6 72.08,60.96 v73.61,59.44 | v73.61,39.01 73.61,21.34 84.28,10.67 84.28,9.45 J6.5
  Bottom 0.152: v73.61,39.01 v73.61,59.44
V5
  Top 0.406: S1.2 111.76,90.17 114.29,87.64 R1.2
  Bottom 0.406: S1.2 111.76,96.38 C1.1 | C1.1 111.11,97.93 110.36,98.68 93.98,98.68 | 93.98,98.68 78.74,98.68 | 78.74,98.68 18.8,98.68 | 18.8,98.68 4.45,98.68 1.52,95.76 1.52,30.48 | U4.32 18.67,95.36 C7.1 18.53,98.41 18.8,98.68 | R14.2 78.88,98.54 78.74,98.68 | R10.2 93.1,97.8 93.98,98.68 | C1.1 112.51,98.42 122.81,98.42 125.6,95.63 125.6,72.39 | 125.6,72.39 125.6,66.04 | 125.6,66.04 125.6,39.37 | 125.6,39.37 125.6,17.91 | 125.6,17.91 125.6,16.51 | R8.2 121.27,16.51 125.6,16.51 | R16.2 112.89,17.91 125.6,17.91 | 125.6,39.37 125.59,39.39 C10.1 110.22,38.99 U$5.14 | U$4.14 108.09,66.18 C9.1 125.46,66.18 125.6,66.04 | 1.52,30.48 1.52,25.4 | 1.52,25.4 1.52,3.56 3.81,1.27 69.85,1.27 | R2.1 1.78,30.23 1.52,30.48 | 1.52,25.4 5.83,25.4 C8.1 6.62,25.15 U1.32 | 69.85,1.27 101.6,1.27 | 101.6,1.27 123.19,1.27 125.6,3.68 125.6,16.51 | J6.12 102.11,1.78 101.6,1.27 | 125.6,72.39 123.46,72.39 C6.1 123.17,72.64 U2.14 | 69.85,1.27 70.1,1.52 J2.1 70.1,11.81 67.17,14.74 | 67.17,14.74 R15.2 | 67.17,14.74 65.41,16.51 65.41,44.32 68.2,47.12 68.2,48.12 C5.1 IC1.11
VIN
  Top 0.406: S1.3 J1.1
WAIT  (via drill 0.25)
  Top 0.152: J6.6 86.87,10.67 84.28,13.26 84.28,31.39 85.8,32.92 86.26,32.92 IC1.24 | v88.09,65.38 88.54,64.92 88.54,50.29 v88.24,49.99
  Bottom 0.152: v88.09,65.38 88.09,73.76 79.86,81.99 79.86,93.12 S3.2 | v88.24,49.99 88.24,45.72 86.56,44.04 85.34,44.04 84.89,43.59 84.89,34.44 86.26,33.07 IC1.24
WRITE_ENABLE_LOW  (via drill 0.25)
  Top 0.152: v70.26,26.67 70.1,26.82 69.95,26.67 v64.16,26.67 | v10.21,24.54 10.52,24.84 10.52,30.94 8.69,32.77 U1.29
  Bottom 0.152: v70.26,26.67 81.08,26.67 82.3,27.89 86.26,27.89 IC1.22 | v64.16,26.67 64.16,12.8 61.11,9.75 61.11,8.84 58.98,6.71 15.24,6.71 14.33,7.62 14.33,10.36 13.41,11.28 12.5,11.28 11.73,12.04 11.73,23.01 v10.21,24.54 | U4.31 21.18,93.12 21.18,89.76 5.79,74.37 5.79,35.66 8.69,32.77 U1.29

### Text on the board
tNames: z80 | d7 | d6 | d5 | d4 | d3 | d2 | d1 | d0 | NMI | RESET | A15-SRAM | a12 | a11 | a10 | a9 | a7 | a0 | v5 | gnd | int | read | busak | sys_clk | wait | busrq | m1 | rfsh | IORQ | halt | v5 | gnd | A14-SWITCH | a13 | a8 | a6 | a5 | a4 | a3 | a2 | a1